# Altium schematic sheet Buzzer.SchDoc
size A; SheetNumber: 3; SheetTotal: 8
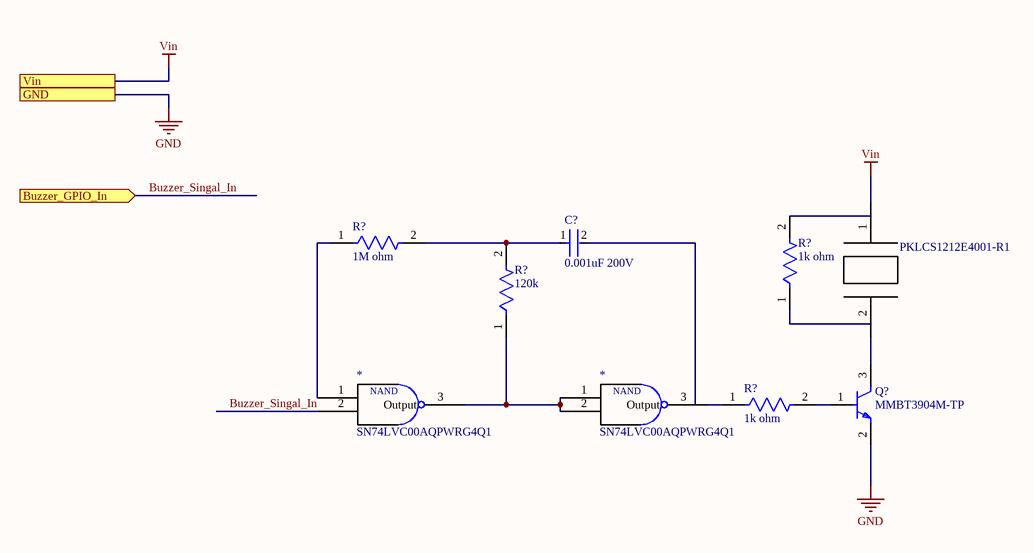
[diagram p0: Buzzer.SchDoc]

## Parts
(Parts that share a designator on the sheet are numbered #1, #2 ... from top to bottom, then left to right.)
*#1  SN74LVC00AQPWRG4Q1  [TSSOP14 NAND]
*#2  SN74LVC00AQPWRG4Q1  [TSSOP14 NAND]
?  PKLCS1212E4001-R1  [SPKR_PKLCS1212E4001-R1]
C?  0.001uF 200V  [FP-C0805C-DN-MFG]
Q?  MMBT3904M-TP  [FP-SOT-883-MFG]
R?#1  1M ohm  [FP-RN73R2A-MFG]
R?#2  1k ohm  [FP-RN732A-IPC_B]
R?#3  120k  [FP-RT0805-MFG]
R?#4  1k ohm  [FP-RN732A-IPC_B]

## Ports
Buzzer_GPIO_In (in), GND, Vin

## Nets
GND: Q?.2(E) ; port GND
Vin: ?.1 ; port Vin
Buzzer_Singal_In: *#1.2 ; port Buzzer_GPIO_In
Net*#1_1: *#1.1 R?#1.1
Net*#1_3: *#1.3(Output) *#2.1 *#2.2 R?#3.1
Net*#2_3: *#2.3(Output) R?#4.1
Net?_2: ?.2 Q?.3(C)
NetC?_1: C?.1 R?#1.2 R?#3.2
NetQ?_1: Q?.1(B) R?#4.2

Not connected (* = marked no-connect by the designer): C? 2; R?#2 1 2

## Notes on the sheet
- (in symbol SN74LVC00AQPWRG4Q1) NAND

## Library data of the parts
*#1 *#2 = SN74LVC00AQPWRG4Q1: IC GATE NAND 4CH 2-INP 14TSSOP; Manufacturer: Texas Instruments; Logic Function: NAND GATE; Min Supply Voltage: 2V; Max Supply Voltage: 3.6V; Propagation Delay: 4.3ns; Number of Inputs: 2; Number of Circuits: 4; Quiescent Current: 10uA; High Level Output Current: 24mA; Number of Output Lines: 1; Supplier 1: Digi-Key; Supplier Part Number 1: 296-SN74LVC00AQPWRG4Q1CT-ND; Manufacturer Part Number: SN74LVC00AQPWRG4Q1; RoHS: Yes; Category: Logic Gates; Stock 1: 2000; Pricing 1: 1=0.59000, 10=0.50500, 25=0.47120, 100=0.37690, 250=0.35000, 500=0.29616, 1000=0.22885 (USD); Mount: Surface Mount; Case/Package: TSSOP; Number of Pins: 14; Weight: 0.002018oz; Min Operating Temperature: -40°C; Max Operating Temperature: 125°C; Packaging: Tape and Reel; Package Quantity: 2000; Low Level Output Current: 24mA; Number of Gates: 4; Number of Input Lines: 2; Turn-On Delay Time: 4.3ns; Number of Bits: 4; Series: 74LVC; Radiation Hardening: No; Lead Free: Lead Free; RoHS Compliant: Yes; ComponentLink1URL: https://datasheet.ciiva.com/14311/sn74lvc00a-q1-14311571.pdf?src-supplier=Avnet; ComponentLink1Description: https://datasheet.ciiva.com/14311/sn74lvc00a-q1-14311571.pdf?src-supplier=Avnet; ComponentLink2URL: https://datasheet.ciiva.com/1872/sn74lvc00a-q1-1872625.pdf?src-supplier=Digi-Key; ComponentLink2Description: https://datasheet.ciiva.com/1872/sn74lvc00a-q1-1872625.pdf?src-supplier=Digi-Key
? = PKLCS1212E4001-R1: MURATA   PKLCS1212E4001-R1   BUZZER, SMD, CONTINUOUS, 75DB, 4KHZ; Max Supply Voltage: 25V; Nominal Input Voltage: 3V; Washable: No; Supplier 1: Digi-Key; Supplier Part Number 1: 490-4683-1-ND; Manufacturer: Murata; Manufacturer Part Number: PKLCS1212E4001-R1; RoHS: Yes; Category: Speakers; Stock 1: 27933; Pricing 1: 1=1.18000, 10=0.98500, 25=0.91200, 50=0.85840, 100=0.80670, 500=0.69408 (USD); Mount: Surface Mount; Min Operating Temperature: -20°C; Max Operating Temperature: 70°C; Termination: Solder; Self Resonant Frequency: 4kHz; Frequency: 4kHz; Packaging: Tape and Reel; Package Quantity: 1; Voltage Rating: 25V; Max Frequency: 4kHz; Voltage Rating (DC): 25V; Diameter: 12mm; Length: 12mm; Width: 12mm; Height: 3mm; Depth: 12mm; Radiation Hardening: No; REACH SVHC: No SVHC; Lead Free: Lead Free; ComponentLink1URL: https://datasheet.ciiva.com/1323/1626578-1323984.pdf?src-supplier=Element14; ComponentLink1Description: https://datasheet.ciiva.com/1323/1626578-1323984.pdf?src-supplier=Element14; ComponentLink2URL: https://datasheet.ciiva.com/4625/pklcs-datasheet-202916-4625328.pdf?src-supplier=Mouser; ComponentLink2Description: https://datasheet.ciiva.com/4625/pklcs-datasheet-202916-4625328.pdf?src-supplier=Mouser; ComponentLink3URL: https://datasheet.ciiva.com/16224/s0039e-16224145.pdf?src-supplier=Future+Electronics; ComponentLink3Description: https://datasheet.ciiva.com/16224/s0039e-16224145.pdf?src-supplier=Future+Electronics; ComponentLink4URL: https://datasheet.ciiva.com/3333/03787173-3333942.pdf?src-supplier=Distrelec; ComponentLink4Description: https://datasheet.ciiva.com/3333/03787173-3333942.pdf?src-supplier=Distrelec; ComponentLink5URL: https://datasheet.ciiva.com/34302/1874527-34302938.pdf?src-supplier=Jameco; ComponentLink5Description: https://datasheet.ciiva.com/34302/1874527-34302938.pdf?src-supplier=Jameco; ComponentLink6URL: https://datasheet.ciiva.com/11776/0900766b807da0c7-11776763.pdf?src-supplier=RSComponents; ComponentLink6Description: https://datasheet.ciiva.com/11776/0900766b807da0c7-11776763.pdf?src-supplier=RSComponents; ComponentLink7URL: https://datasheet.ciiva.com/1743/9058-1743648.pdf?src-supplier=Newark; ComponentLink7Description: https://datasheet.ciiva.com/1743/9058-1743648.pdf?src-supplier=Newark; ComponentLink8URL: https://datasheet.ciiva.com/1323/9058-1323985.pdf?src-supplier=Element14; ComponentLink8Description: https://datasheet.ciiva.com/1323/9058-1323985.pdf?src-supplier=Element14; ComponentLink9URL: https://datasheet.ciiva.com/18141/p37e-18141127.pdf?src-supplier=Verical; ComponentLink9Description: https://datasheet.ciiva.com/18141/p37e-18141127.pdf?src-supplier=Verical; ComponentLink10URL: https://datasheet.ciiva.com/8084/p37e-8084265.pdf?src-supplier=Avnet; ComponentLink10Description: https://datasheet.ciiva.com/8084/p37e-8084265.pdf?src-supplier=Avnet; ComponentLink11URL: https://datasheet.ciiva.com/0/s0039e-123.pdf?src-supplier=Digi-Key; ComponentLink11Description: https://datasheet.ciiva.com/0/s0039e-123.pdf?src-supplier=Digi-Key; ComponentLink12URL: https://datasheet.ciiva.com/0/s0039e-124.pdf?src-supplier=Digi-Key; ComponentLink12Description: https://datasheet.ciiva.com/0/s0039e-124.pdf?src-supplier=Digi-Key; ComponentLink13URL: https://datasheet.ciiva.com/0/s0039e-125.pdf?src-supplier=Digi-Key; ComponentLink13Description: https://datasheet.ciiva.com/0/s0039e-125.pdf?src-supplier=Digi-Key; ComponentLink14URL: https://datasheet.ciiva.com/16551/p37e-16551309.pdf?src-supplier=Avnet+Europe; ComponentLink14Description: https://datasheet.ciiva.com/16551/p37e-16551309.pdf?src-supplier=Avnet+Europe
C? = CMP-2007-00240-2: Cap Ceramic 0.001uF 200V X7R 10% Pad SMD 0805 125C Automotive T/R; Manufacturer: KEMET; Manufacturer Part Number: C0805C102K2RACAUTO; Capacitance: 1,000 pF; Temperature Coefficient: 30ppm/°C; Tolerance: 0.1; Value: 1,000 pF; Height: 0.88mm; Device Class L2: Capacitors; Material: Ceramic; Mouser Description: Cap Ceramic 0.001uF 200V X7R 10% Pad SMD 0805 125C Automotive T/R; ComponentLink2Description: Datasheet; Temperature Range Low: -55°C; ComponentLink2URL: https://content.kemet.com/datasheets/KEM_C1003_C0G_SMD.pdf; Ipc Land Pattern Name: CAPC200125X78; Device Class L3: Ceramic Capacitors; Octopart: https://octopart.com/c0805c102k2racauto-kemet-17283714; Temperature Range High: +125°C; Temperature Characteristic: X7R; Device Class L1: Passive Components; Lead Free: Yes; Automotive: No; Voltage Rating: 200 V; Digikey Description: Cap Ceramic 0.001uF 200V X7R 10% Pad SMD 0805 125C Automotive T/R; Package: C0805C-DN; Temperature: -55°C to +125°C; Category: Cap; RoHS: TRUE
Q? = CMP-56214-000001-1: TRANSISTOR NPN SOT883
R?#1 = CMP-04015-053334-1: 1MΩ ±0.25% 0.125W, 1/8W Chip Resistor 0805 (2012 Metric) Moisture Resistant Thin Film
R?#2 R?#4 = CMP-2001-02559-2: 1kΩ ±0.1% 0.1W, 1/10W Chip Resistor 0805 (2012 Metric) Moisture Resistant Thin Film; Resistance: 1kR; Temperature Coefficient: 25ppm/°C; Power Rating: 100mW; Voltage Rating: 100V; Mount: Surface Mount; Max Operating Temperature: 125°C; Termination: SMD/SMT; Min Operating Temperature: -55°C; Case/Package: 0805; Case Code (Imperial): 0805; Case Code (Metric): 2012; Packaging: Tape and Reel; Voltage Rating (DC): 100V; Tolerance: 0.1%
R?#3 = CMP-2001-01760-2: RES SMD 120K OHM 0.1% 1/8W 0805; Manufacturer Part Number: RT0805BRE07120KL; Manufacturer: Yageo; Value: 120KΩ; Temperature Coefficient: 50 ppm/°C; Power Rating: 0.125W; Tolerance: 0.0025; Voltage Rating: 150V; Composition: Thin Film; Temperature: -55°C to +155°C; ComponentLink2Description: Datasheet; Category: Res; Device Class L2: Resistors; Octopart: https://octopart.com/rt0805bre07120kl-yageo-1226287; Temperature Range High: +155°C; Ipc Land Pattern Name: RESC200125X50; RoHS: TRUE; Package: RT0805; Digikey Description: RES SMD 120K OHM 0.1% 1/8W 0805; Resistance: 120KΩ; Device Class L1: Passive Components; Series: RT; Height: 0.6mm; Device Class L3: Chip SMD Resistors; Temperature Range Low: -55°C; ComponentLink2URL: http://www.yageo.com/documents/recent/PYu-RT_1-to-0.01_RoHS_L_9.pdf; Footprint Url: http://www.yageo.com/exep/pages/download/literatures/PYu-R_Mount_10.pdf; Automotive: No; Lead Free: Yes